# EAGLE design untitled (EAGLE 6.5.0)
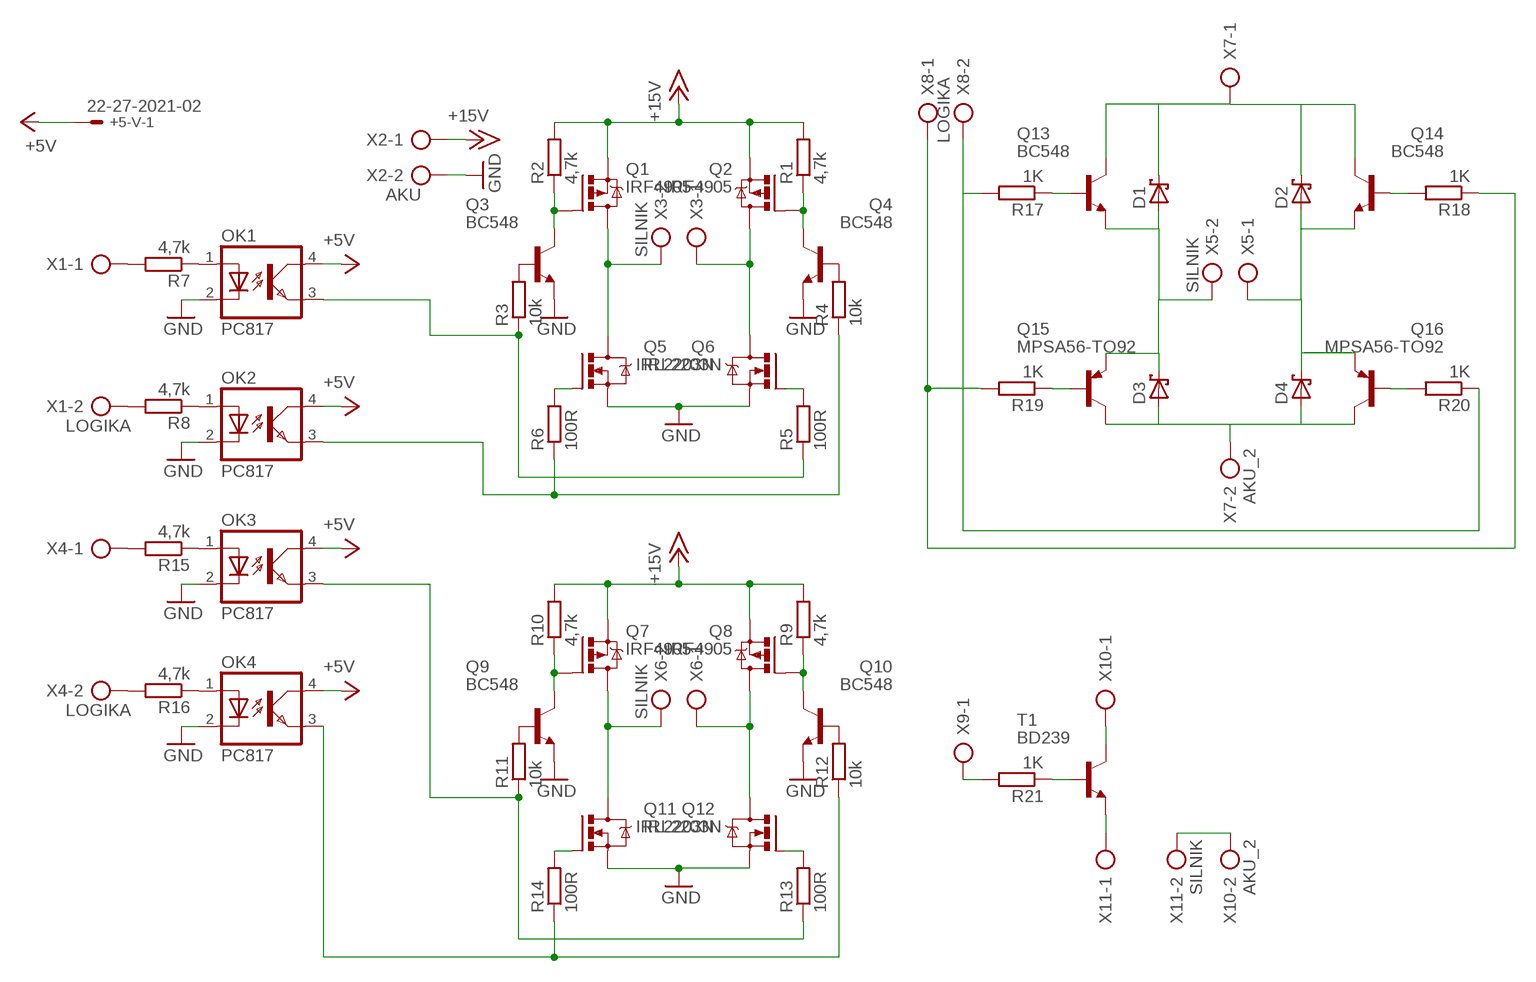
[diagram p0: schematic, sheet 1]

## Parts
+5-V  22-27-2021-02  [6410-02]
D1  SCHOTTKY-DIODEDO35-7  [DO35-7]
D2  SCHOTTKY-DIODEDO35-7  [DO35-7]
D3  SCHOTTKY-DIODEDO35-7  [DO35-7]
D4  SCHOTTKY-DIODEDO35-7  [DO35-7]
OK1  PC817  [DIL04]
OK2  PC817  [DIL04]
OK3  PC817  [DIL04]
OK4  PC817  [DIL04]
Q1  IRF4905  [TO220BH]
Q2  IRF4905  [TO220BH]
Q3  BC548  [TO92-EBC]
Q4  BC548  [TO92-EBC]
Q5  IRL2203N  IRF540  [TO220BV]
Q6  IRL2203N  IRF540  [TO220BV]
Q7  IRF4905  [TO220BH]
Q8  IRF4905  [TO220BH]
Q9  BC548  [TO92-EBC]
Q10  BC548  [TO92-EBC]
Q11  IRL2203N  IRF540  [TO220BV]
Q12  IRL2203N  IRF540  [TO220BV]
Q13  BC548  [TO92-EBC]
Q14  BC548  [TO92-EBC]
Q15  MPSA56-TO92  [TO92-CBE]
Q16  MPSA56-TO92  [TO92-CBE]
R1  4,7k  R-EU_0207/7  [0207/7]
R2  4,7k  R-EU_0207/7  [0207/7]
R3  10k  R-EU_0207/7  [0207/7]
R4  10k  R-EU_0207/7  [0207/7]
R5  100R  R-EU_0207/7  [0207/7]
R6  100R  R-EU_0207/7  [0207/7]
R7  4,7k  R-EU_0207/7  [0207/7]
R8  4,7k  R-EU_0207/7  [0207/7]
R9  4,7k  R-EU_0207/7  [0207/7]
R10  4,7k  R-EU_0207/7  [0207/7]
R11  10k  R-EU_0207/7  [0207/7]
R12  10k  R-EU_0207/7  [0207/7]
R13  100R  R-EU_0207/7  [0207/7]
R14  100R  R-EU_0207/7  [0207/7]
R15  4,7k  R-EU_0207/7  [0207/7]
R16  4,7k  R-EU_0207/7  [0207/7]
R17  1K  R-EU_0207/7  [0207/7]
R18  1K  R-EU_0207/7  [0207/7]
R19  1K  R-EU_0207/7  [0207/7]
R20  1K  R-EU_0207/7  [0207/7]
R21  1K  R-EU_0207/7  [0207/7]
T1  BD239  [TO220]
X1  LOGIKA  AK500/2  [AK500/2]
X2  AKU  AK500/2  [AK500/2]
X3  SILNIK  AK500/2  [AK500/2]
X4  LOGIKA  AK500/2  [AK500/2]
X5  SILNIK  AK500/2  [AK500/2]
X6  SILNIK  AK500/2  [AK500/2]
X7  AKU_2  AK500/2  [AK500/2]
X8  LOGIKA  AK500/2  [AK500/2]
X9  LOGIKA  AK500/2  [AK500/2]
X10  AKU_2  AK500/2  [AK500/2]
X11  SILNIK  AK500/2  [AK500/2]

## Nets
+5V: +5-V.1 OK1.4(COL) OK2.4(COL) OK3.4(COL) OK4.4(COL)
+15V: Q1.S Q2.S Q7.S Q8.S R1.2 R2.2 R9.2 R10.2 X2.1
GND: OK1.2(C) OK2.2(C) OK3.2(C) OK4.2(C) Q3.E Q4.E Q5.S Q6.S Q9.E Q10.E Q11.S Q12.S X2.2
N$1: Q1.G Q3.C R2.1
N$2: Q2.G Q4.C R1.1
N$3: Q3.B R3.2
N$4: Q4.B R4.2
N$5: Q5.G R6.2
N$6: Q6.G R5.2
N$7: OK1.3(EMIT) R3.1 R5.1
N$8: Q1.D Q5.D X3.2
N$9: Q2.D Q6.D X3.1
N$10: OK2.3(EMIT) R4.1 R6.1
N$11: OK1.1(A) R7.1
N$12: OK2.1(A) R8.1
N$13: R7.2 X1.1
N$14: R8.2 X1.2
N$15: Q7.G Q9.C R10.1
N$16: Q8.G Q10.C R9.1
N$17: Q9.B R11.2
N$18: Q10.B R12.2
N$19: Q11.G R14.2
N$20: Q12.G R13.2
N$21: Q7.D Q11.D X6.2
N$22: Q8.D Q12.D X6.1
N$23: OK3.3(EMIT) R11.1 R13.1
N$24: OK4.3(EMIT) R12.1 R14.1
N$25: R15.2 X4.1
N$26: R16.2 X4.2
N$27: OK3.1(A) R15.1
N$28: OK4.1(A) R16.1
N$29: Q13.B R17.1
N$30: Q15.B R19.1
N$31: D1.C D2.C Q13.C Q14.C X7.1
N$32: R18.1 R19.2 X8.1
N$33: Q14.B R18.2
N$34: D2.A D4.C Q14.E Q16.E X5.1
N$35: D3.A D4.A Q15.C Q16.C X7.2
N$36: Q16.B R20.2
N$37: D1.A D3.C Q13.E Q15.E X5.2
N$38: R17.2 R20.1 X8.2
N$39: R21.1 T1.1(B)
N$40: R21.2 X9.1
N$41: T1.2(C) X10.1
N$42: T1.3(E) X11.1
N$43: X10.2 X11.2
Unconnected: +5-V.2 X9.2

## Library data of the parts
+5-V = con-molex:22-?-02: CONNECTOR wire to board 2.54 mm (.1 inch) pitch header; OC_FARNELL: unknown; OC_NEWARK: unknown
D1-D4 = diode:SCHOTTKY-DIODE: Schottky Diode
OK1-OK4 = optocoupler:PC817: SHARP OPTO COUPLER; MPN: PC817X4J000F; OC_FARNELL: 9707727; OC_NEWARK: 97K7059
Q1 Q2 Q7 Q8 = transistor-power:IRF4905: P-Channel HEXFET® Power MOSFET RDS(on)= 0.02 Ohm, ID = -74A Source: http://www.irf.com/product-info/datasheets/data/irf4905pbf.pdf
Q3 Q4 Q9 Q10 Q13 Q14 = transistor-npn:BC548*: NPN Transistor
Q5 Q6 Q11 Q12 = transistor-power:IRF540: HEXFET Power MOSFET
Q15 Q16 = transistor-pnp:*-?: PNP Transistor
R1-R21 = rcl:R-EU_: RESISTOR, European symbol
T1 = transistor:BD239: NPN TRANSISTOR Source: http://www.fairchildsemi.com/ds/BD/BD239C.pdf
X1-X11 = con-ptr500:AK500/2: CONNECTOR; OC_FARNELL: unknown; OC_NEWARK: unknown

## Board
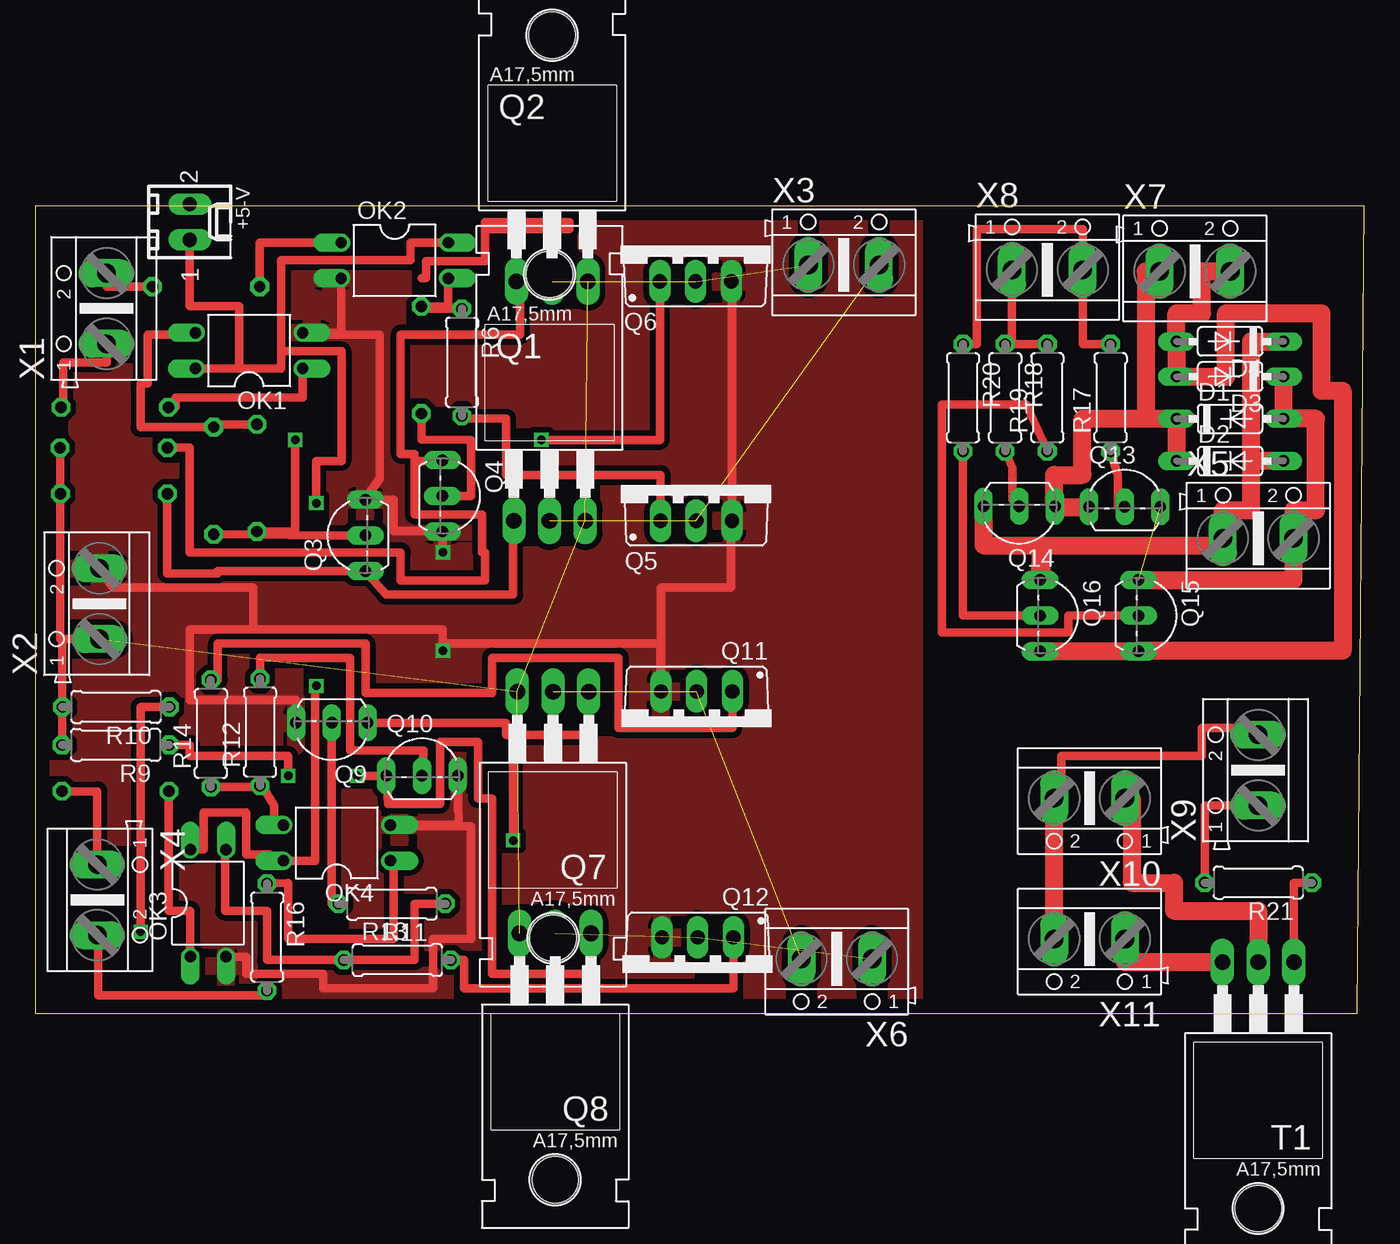
[diagram p1: board, top side]
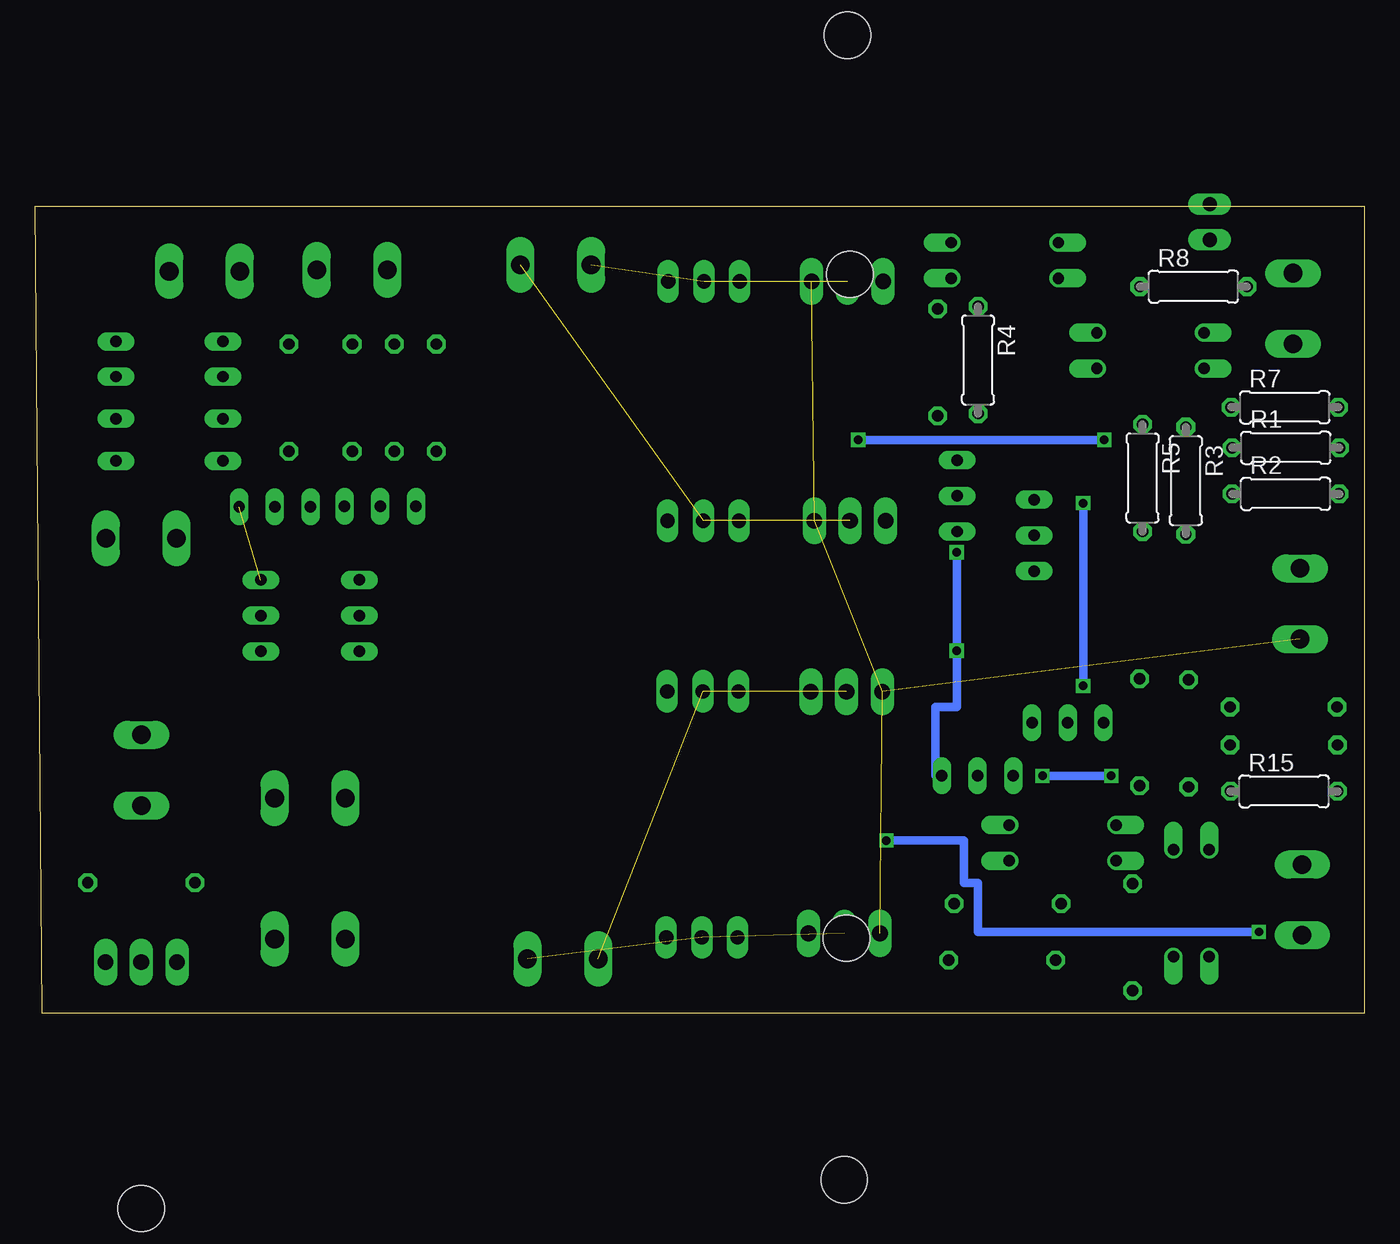
[diagram p2: board, bottom side, seen from below]

Size 94.55 x 57.42 mm. Coordinates in mm from the lower left corner, seen from the top.
Outline: 0,0 94.05,0 94.55,57.42 0,57.42 0,0
Copper layers (1*16): Top 0.035mm / dielectric 1.5mm / Bottom 0.035mm
Design rules "default": minimum track width 10mil, minimum drill 24mil, track to track 8mil, track to pad 8mil, pad to pad 8mil, via to via 8mil, smd to smd 8mil, copper to edge 40mil, drill to drill 8mil, minimum pad ring 10mil, minimum via ring 8mil, stop-mask expansion 4mil, vias tented up to drill 0mil, thermal gap 10mil

### Footprints (pad centres in the part's own frame; a part is rotated, then mirrored left to right if it is on the bottom)
6410-02 = drill 1.016 long: 1 1.27,0; 2 -1.27,0
DO35-7 = drill 0.813 long: A 3.81,0; C -3.81,0
DIL04 = drill 0.813 offset: 1 -1.27,-3.81; 2 1.27,-3.81; 3 1.27,3.81; 4 -1.27,3.81
TO220BH = drill 1.118 long: D 0,-6.35; G -2.54,-6.35; S 2.54,-6.35 | hole 3.302: 0,11.176
TO92-EBC = drill 0.813 long: B 0,-1.27; C -2.54,-1.27; E 2.54,-1.27
TO220BV = drill 1.016 long: D 0,-2.54; G -2.54,-2.54; S 2.54,-2.54
TO92-CBE = drill 0.813 long: B 0,0; C 2.54,0; E -2.54,0
0207/7 = drill 0.813 octagon: 1 -3.81,0; 2 3.81,0
TO220 = drill 1.118 long: 1 -2.54,-6.35; 2 0,-6.35; 3 2.54,-6.35 | hole 3.302: 0,11.176
AK500/2 = drill 1.321 long: 1 -2.515,0; 2 2.515,0

### Placement (x,y rotation side)
+5-V  11,56.29 270 top
D1  85,42.29 0 top
D2  85,39.29 0 top
D3  85,45.29 180 top
D4  85,47.79 180 top
OK1  15.22,47.14 90 top
OK2  25.57,53.55 270 top
OK3  12.3,7.83 0 top
OK4  21.45,12.12 90 top
Q1  36.59,41.38 0 top
Q2  36.77,58.41 0 top
Q3  22.21,33.99 90 top
Q4  30.23,36.81 270 top
Q5  47.02,37.58 0 top
Q6  46.98,54.59 0 top
Q7  36.84,16.52 180 top
Q8  36.99,-0.66 180 top
Q9  21.1,19.4 180 top
Q10  27.52,18.18 0 top
Q11  47.05,20.36 180 top
Q12  47.12,2.86 180 top
Q13  77.5,37.29 0 top
Q14  70,34.79 180 top
Q15  78.5,28.29 270 top
Q16  71.5,28.29 270 top
R1  5.59,40.23 0 bottom
R2  5.6,36.95 0 bottom
R3  12.7,37.89 270 bottom
R4  27.48,46.47 270 bottom
R5  15.78,38.08 270 bottom
R6  30.36,46.31 270 top
R7  5.66,43.11 0 bottom
R8  12.16,51.69 0 bottom
R9  5.73,19.09 180 top
R10  5.75,21.79 180 top
R11  25.37,7.79 180 top
R12  16,20 90 top
R13  25.77,3.79 0 top
R14  12.5,19.91 90 top
R15  5.71,15.79 0 bottom
R16  16.5,5.42 270 top
R17  76.5,43.79 90 top
R18  69,43.79 270 top
R19  72,43.79 90 top
R20  66,43.79 270 top
R21  87,9.29 180 top
T1  87,-2.71 180 top
X1  5.08,50.13 90 top
X2  4.58,29.14 90 top
X3  57.52,53.23 0 top
X4  4.42,8.07 270 top
X5  87,33.79 0 top
X6  57.02,3.87 180 top
X7  82.5,52.79 0 top
X8  72,52.89 0 top
X9  87,17.29 90 top
X10  75,15.29 180 top
X11  75,5.29 180 top

### Tracks (layer width: path | path; a pad name or v marks a point on that pad's centre or on a via)
+5V  (via drill 0.6)
  Top 0.61: OK1.4 14.5,45.88 | 14.5,45.88 17.5,45.88 17.5,47.09 | 17.5,47.09 17.5,53.59 26.7,53.59 26.7,54.82 OK2.4 | 14.5,45.88 14.5,50.29 11,50.29 +5-V.1 | 17.5,47.09 21.8,47.09 21.8,39.29 20,39.29 v20,36.29 | OK3.4 12,11.64 12,14.29 15,14.29 15,11.29 16.64,11.29 OK4.4 19.9,10.85 19.9,23.19 20,23.19 v20,23.29
  Bottom 0.61: v20,36.29 v20,23.29
+15V  (4 unrouted)
  Top 0.61: R1.2 R2.2 1.79,26.62 X2.1 1.94,26.62 R10.2 1.92,21.79 R9.2
GND  (via drill 0.6)
  Top 0.61: OK2.2 21.77,48.41 OK1.2 20.53,48.29 24.5,48.29 24.5,38.03 Q3.E 25.5,36.53 25.5,34.29 25.96,34.29 | Q4.E 25.96,34.29 | 25.96,34.29 29,34.29 v29,32.79 | 15.5,27.29 29,27.29 v29,25.79 29,26.29 44.5,26.29 44.5,22.9 Q11.S 44.52,30.29 49.5,30.29 49.5,35.03 Q5.S 49.56,52.05 Q6.S | 15.5,27.29 15.5,30.29 5.5,30.29 4.5,31.66 X2.2 | Q10.E 30.12,13.39 OK4.2 27.27,13.29 31,13.29 31,5.29 28.3,5.29 28.3,1.79 20.5,1.79 20.5,2.79 15,2.79 15,4.02 OK3.2 | Q9.E 18.56,22.29 11,22.29 11,27.29 15.5,27.29
  Bottom 0.61: v29,32.79 v29,25.79 29,21.79 30.5,21.79 30.5,16.91 Q10.E
  pour Top (isolate 0.406): 0,57.29 62.5,57.29 62.5,-0.21 0,-0.21
N$1
  Top 0.61: Q1.G 34,35.03 34,29.79 24.98,29.79 Q3.C 13,31.45 13,31.29 9.41,31.29 R2.1
N$2
  Top 0.61: 27,39.29 27,39.79 26,39.79 26,48.29 34.5,48.29 34.5,52.05 Q2.G | Q4.C 28.96,39.29 27,39.29 | 27,39.29 27,35.49 31.8,35.49 31.8,32.79 32,32.79 32,30.79 26,30.79 26,32.79 11,32.79 11,40.23 R1.1
N$3
  Top 0.61: Q3.B 20.71,33.99 R3.2
N$4
  Top 0.61: R4.2 27.48,40.81 31,40.79 31,36.81 Q4.B
N$5
  Top 0.61: R6.2 30.36,42.29 33.5,42.29 33.5,38.29 44.5,38.29 44.5,35.03 Q5.G
N$6  (via drill 0.6)
  Top 0.61: R5.2 18.5,34.27 v18.5,40.79 | v36,40.79 44.44,40.79 Q6.G
  Bottom 0.61: v18.5,40.79 v36,40.79
N$7
  Top 0.61: OK1.3 11.41,48.29 8,48.29 8,44.79 7.5,44.79 7.5,41.7 R3.1 12.7,41.89 R5.1
N$8  (2 unrouted)
N$9  (2 unrouted)
N$10
  Top 0.61: OK2.3 29.39,50.28 R4.1 27.48,50.12 R6.1
N$11
  Top 0.61: R7.1 10,43.11 10,43.79 19.03,43.79 OK1.1
N$12
  Top 0.61: R8.1 15.97,54.82 OK2.1
N$13
  Top 0.61: X1.1 5.08,46.29 2,46.29 2,43.11 R7.2
N$14
  Top 0.61: X1.2 5.08,51.69 R8.2
N$15  (via drill 0.6)
  Top 0.61: Q9.C 33.5,20.67 33.5,19.79 34,19.79 | 34,19.79 39.38,19.79 Q7.G | R10.1 7.5,21.79 v7.5,5.79 | v34,12.29 34,19.79
  Bottom 0.61: v7.5,5.79 27.5,5.79 27.5,9.29 28.5,9.29 28.5,12.29 v34,12.29
N$16  (via drill 0.6)
  Top 0.61: 9.5,19.09 R9.1 11,19.09 11,18.29 18,18.29 v18,16.89 | Q8.G 39.5,5.68 39.5,2.79 32.5,2.79 32.5,15.29 31.5,15.29 31.5,19.29 28.8,19.29 28.8,14.91 25.1,14.91 Q10.C 25.08,16.89 v22.9,16.89
  Bottom 0.61: v22.9,16.89 v18,16.89
N$17
  Top 0.61: R11.2 21.1,7.79 Q9.B
N$18
  Top 0.61: R12.2 16,25.31 18,25.29 22.4,25.29 22.4,18.69 27.62,18.69 Q10.B
N$19
  Top 0.61: R14.2 13,23.72 13,26.29 23.5,26.29 23.5,22.79 32.5,22.79 32.5,25.29 41.5,25.29 41.5,20.29 49.59,20.29 Q11.G
N$20
  Top 0.61: R13.2 30.5,3.79 30.5,1.79 49.66,1.79 Q12.G
N$21  (2 unrouted)
N$22  (2 unrouted)
N$23
  Top 0.61: OK3.3 13.5,11.64 13.5,7.29 16.5,7.29 16.5,3.79 R13.1 27,3.79 27,7.79 R11.1
N$24
  Top 0.61: R14.1 16,16.1 R12.1 16.14,16.19 17,14.79 17,13.39 OK4.3
N$25
  Top 0.61: R15.2 4.42,15.79 X4.1
N$26
  Top 0.61: X4.2 4.5,5.55 4.5,1.29 16.5,1.29 R16.2
N$27
  Top 0.61: R15.1 9.5,15.79 9.5,7.29 11.04,7.29 OK3.1
N$28
  Top 0.61: OK4.1 25.5,10.85 25.5,5.29 18,5.29 18,9.29 R16.1
N$29
  Top 0.61: R17.1 77,38.29 77,36.02 Q13.B
N$30
  Top 0.61: R19.1 70.5,43.29 64.5,43.29 64.5,27.09 73.5,27.09 73.5,28.29 Q15.B
N$31
  Top 1.27: Q13.C 72.54,36.02 Q14.C 72.5,36.56 72.5,38.29 74.5,38.29 74.5,42.29 79,42.29 | 79,42.29 D1.C D2.C | X7.1 79,52.79 79,42.29
N$32
  Top 0.61: X8.1 69.48,47.6 R18.1 R19.2
N$33
  Top 0.61: R18.2 69.5,38.79 69.5,36.56 Q14.B
N$34
  Top 1.27: Q14.E 67.46,33.29 71.54,33.29 | 71.54,33.29 71.7,33.29 | 71.7,33.29 Q16.E 71.54,33.29 | 71.7,33.29 84.5,33.29 84.5,32.79 X5.1 84.48,35.79 86.5,35.79 86.5,39.29 | D2.A 86.5,39.29 | 86.5,39.29 86.5,47.79 D4.C
N$35
  Top 1.27: Q16.C 70.96,25.79 78.5,25.79 | 80,25.79 78.5,25.79 | 78.5,25.79 Q15.C 80.04,25.79 93,25.79 93,44.29 91.5,44.29 91.5,49.79 84.7,49.79 84.7,45.29 D3.A D4.A 81.19,49.79 83,49.79 83,52.79 X7.2
N$36
  Top 0.61: R20.2 66,28.29 Q16.B
N$37  (1 unrouted)
  Top 1.27: D3.C D1.A 91.1,42.29 91.1,35.79 89.52,35.79 X5.2 89.52,30.83 Q15.E
N$38
  Top 0.61: R17.2 74.52,47.6 74.52,52.29 X8.2 74.52,55.79 67,55.79 67,47.6 R20.1
N$39
  Top 0.61: R21.1 89.54,9.29 T1.1
N$40
  Top 0.61: X9.1 83.19,14.77 R21.2
N$41
  Top 1.27: X10.1 78,15.29 78,9.29 81,9.29 81,7.29 87,7.29 T1.2
N$42
  Top 1.27: T1.3 77.52,3.64 X11.1
N$43
  Top 1.27: X11.2 X10.2
N$44
  Top 0.61: 87,20.29 83,20.29 83,18.29 73,18.29 73,15.29
N$45
  Top 0.61: 27.5,52.29 27.8,52.29 27.8,53.49 32,53.49 32,55.79 | 32,55.79 32,56.29 38,56.29 38,55.79 32,55.79